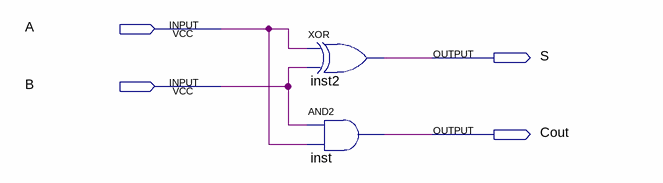
[diagram p0: schematic sheet]
// Quartus schematic HA.bdf as structural Verilog: 2 symbols, 4 pins
module HA (
  input  A,
  input  B,
  output S,
  output Cout
);

  xor inst2 (S, A, B);
  and inst (Cout, B, A);
endmodule
